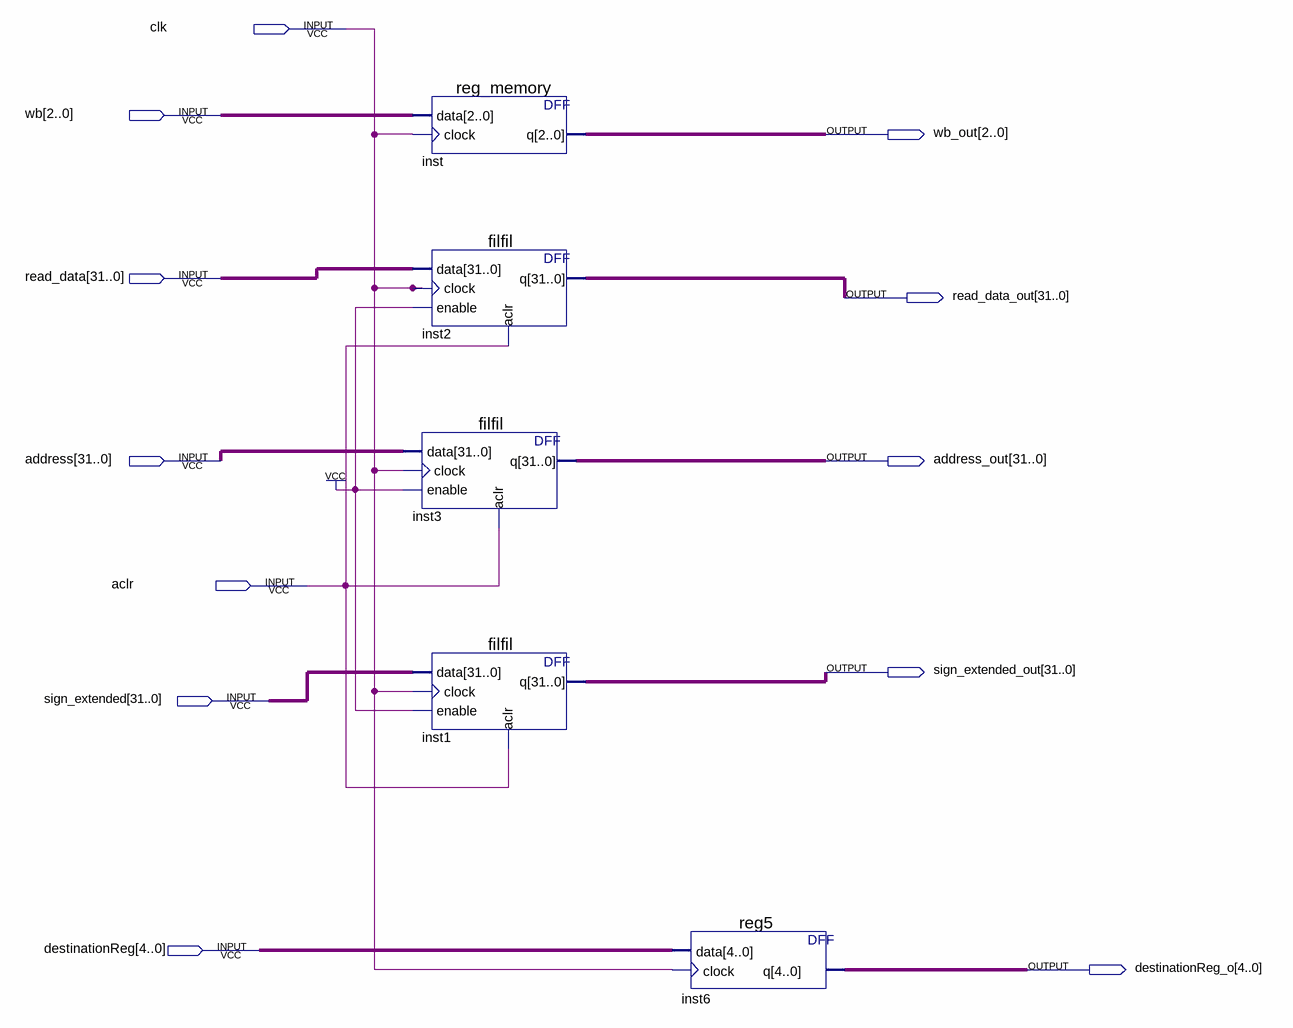
[diagram p0: schematic sheet]
// Quartus schematic memwb.bdf as structural Verilog: 5 symbols, 12 pins
module memwb (
  input  clk,
  input  [2:0] wb,
  input  [31:0] read_data,
  input  [31:0] address,
  input  aclr,
  input  [31:0] sign_extended,
  input  [4:0] destinationReg,
  output [2:0] wb_out,
  output [31:0] read_data_out,
  output [31:0] address_out,
  output [31:0] sign_extended_out,
  output [4:0] destinationReg_o
);

  reg_memory inst (.data(wb), .clock(clk), .q(wb_out));
  filfil inst2 (.data(read_data), .clock(clk), .enable(1'b1), .aclr(aclr), .q(read_data_out));
  filfil inst3 (.data(address), .clock(clk), .enable(1'b1), .aclr(aclr), .q(address_out));
  filfil inst1 (.data(sign_extended), .clock(clk), .enable(1'b1), .aclr(aclr), .q(sign_extended_out));
  reg5 inst6 (.data(destinationReg), .clock(clk), .q(destinationReg_o));
endmodule
